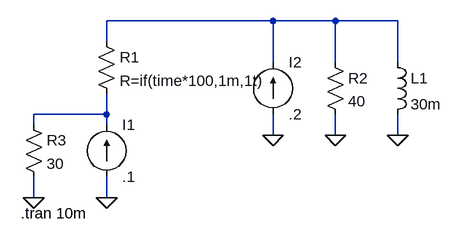
[diagram p0: schematic 8-53.asc]
8-53.asc, the LTspice schematic file:
Version 4
SHEET 1 880 680
WIRE 352 0 96 0
WIRE 448 0 352 0
WIRE 544 0 448 0
WIRE 96 32 96 0
WIRE 352 64 352 0
WIRE 448 64 448 0
WIRE 544 64 544 0
WIRE 96 144 96 112
WIRE 96 144 -16 144
WIRE -16 160 -16 144
WIRE 96 160 96 144
WIRE 352 176 352 144
WIRE 448 176 448 144
WIRE 544 176 544 144
WIRE -16 272 -16 240
WIRE 96 272 96 240
FLAG 96 272 0
FLAG -16 272 0
FLAG 352 176 0
FLAG 448 176 0
FLAG 544 176 0
SYMBOL current 96 240 M180
WINDOW 0 24 80 Left 2
WINDOW 3 24 0 Left 2
WINDOW 123 0 0 Left 2
WINDOW 39 0 0 Left 2
SYMATTR InstName I1
SYMATTR Value .1
SYMBOL current 352 144 M180
WINDOW 0 24 80 Left 2
WINDOW 3 24 0 Left 2
WINDOW 123 0 0 Left 2
WINDOW 39 0 0 Left 2
SYMATTR InstName I2
SYMATTR Value .2
SYMBOL res 80 16 R0
SYMATTR InstName R1
SYMATTR Value R=if(time*100,1m,1t)
SYMBOL res 432 48 R0
SYMATTR InstName R2
SYMATTR Value 40
SYMBOL ind 528 48 R0
SYMATTR InstName L1
SYMATTR Value 30m
SYMBOL res -32 144 R0
SYMATTR InstName R3
SYMATTR Value 30
TEXT -36 296 Left 2 !.tran 10m

The netlist it stands for:
* 8-53.asc
I1 0 N002 .1
I2 0 N001 .2
R1 N001 N002 R=if(time*100,1m,1t)
R2 N001 0 40
L1 N001 0 30m
R3 N002 0 30
.tran 10m
.backanno
.end